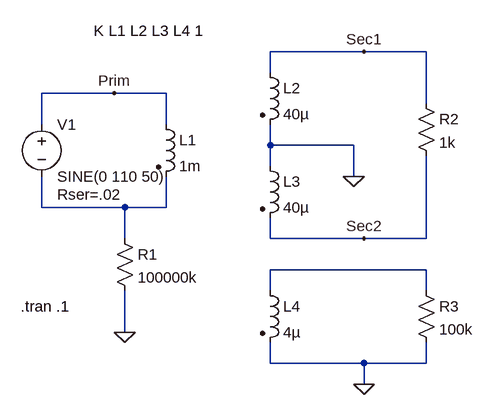
[diagram p0: schematic Transform3CenterTap.asc]
Transform3CenterTap.asc, the LTspice schematic file:
Version 4
SHEET 1 880 680
WIRE 448 0 304 0
WIRE 544 0 448 0
WIRE 304 32 304 0
WIRE 64 64 -48 64
WIRE 144 64 64 64
WIRE 544 80 544 0
WIRE -48 112 -48 64
WIRE 144 112 144 64
WIRE 304 144 304 112
WIRE 432 144 304 144
WIRE 304 176 304 144
WIRE 432 192 432 144
WIRE -48 240 -48 192
WIRE 80 240 -48 240
WIRE 144 240 144 192
WIRE 144 240 80 240
WIRE 80 288 80 240
WIRE 304 288 304 256
WIRE 448 288 304 288
WIRE 544 288 544 160
WIRE 544 288 448 288
WIRE 544 336 304 336
WIRE 304 368 304 336
WIRE 544 368 544 336
WIRE 80 432 80 368
WIRE 304 480 304 448
WIRE 448 480 304 480
WIRE 544 480 544 448
WIRE 544 480 448 480
WIRE 448 512 448 480
FLAG 80 432 0
FLAG 432 192 0
FLAG 64 64 Prim
FLAG 448 0 Sec1
FLAG 448 288 Sec2
FLAG 448 512 0
SYMBOL ind2 128 96 R0
SYMATTR InstName L1
SYMATTR Value 1m
SYMBOL ind2 288 16 R0
SYMATTR InstName L2
SYMATTR Value 40µ
SYMBOL ind2 288 160 R0
SYMATTR InstName L3
SYMATTR Value 40µ
SYMBOL voltage -48 96 R0
WINDOW 123 0 0 Left 0
WINDOW 39 24 124 Left 2
SYMATTR SpiceLine Rser=.02
SYMATTR InstName V1
SYMATTR Value SINE(0 110 50)
SYMBOL res 64 272 R0
SYMATTR InstName R1
SYMATTR Value 100000k
SYMBOL res 528 64 R0
SYMATTR InstName R2
SYMATTR Value 1k
SYMBOL ind2 288 352 R0
SYMATTR InstName L4
SYMATTR Value 4µ
SYMBOL res 528 352 R0
SYMATTR InstName R3
SYMATTR Value 100k
TEXT 32 -32 Left 2 !K L1 L2 L3 L4 1
TEXT -80 392 Left 2 !.tran .1

The netlist it stands for:
* Transform3CenterTap.asc
L1 Prim N001 1m
L2 Sec1 0 40µ
L3 0 Sec2 40µ
V1 Prim N001 SINE(0 110 50) Rser=.02
R1 N001 0 100000k
R2 Sec1 Sec2 1k
L4 N002 0 4µ
R3 N002 0 100k
K L1 L2 L3 L4 1
.tran .1
.backanno
.end